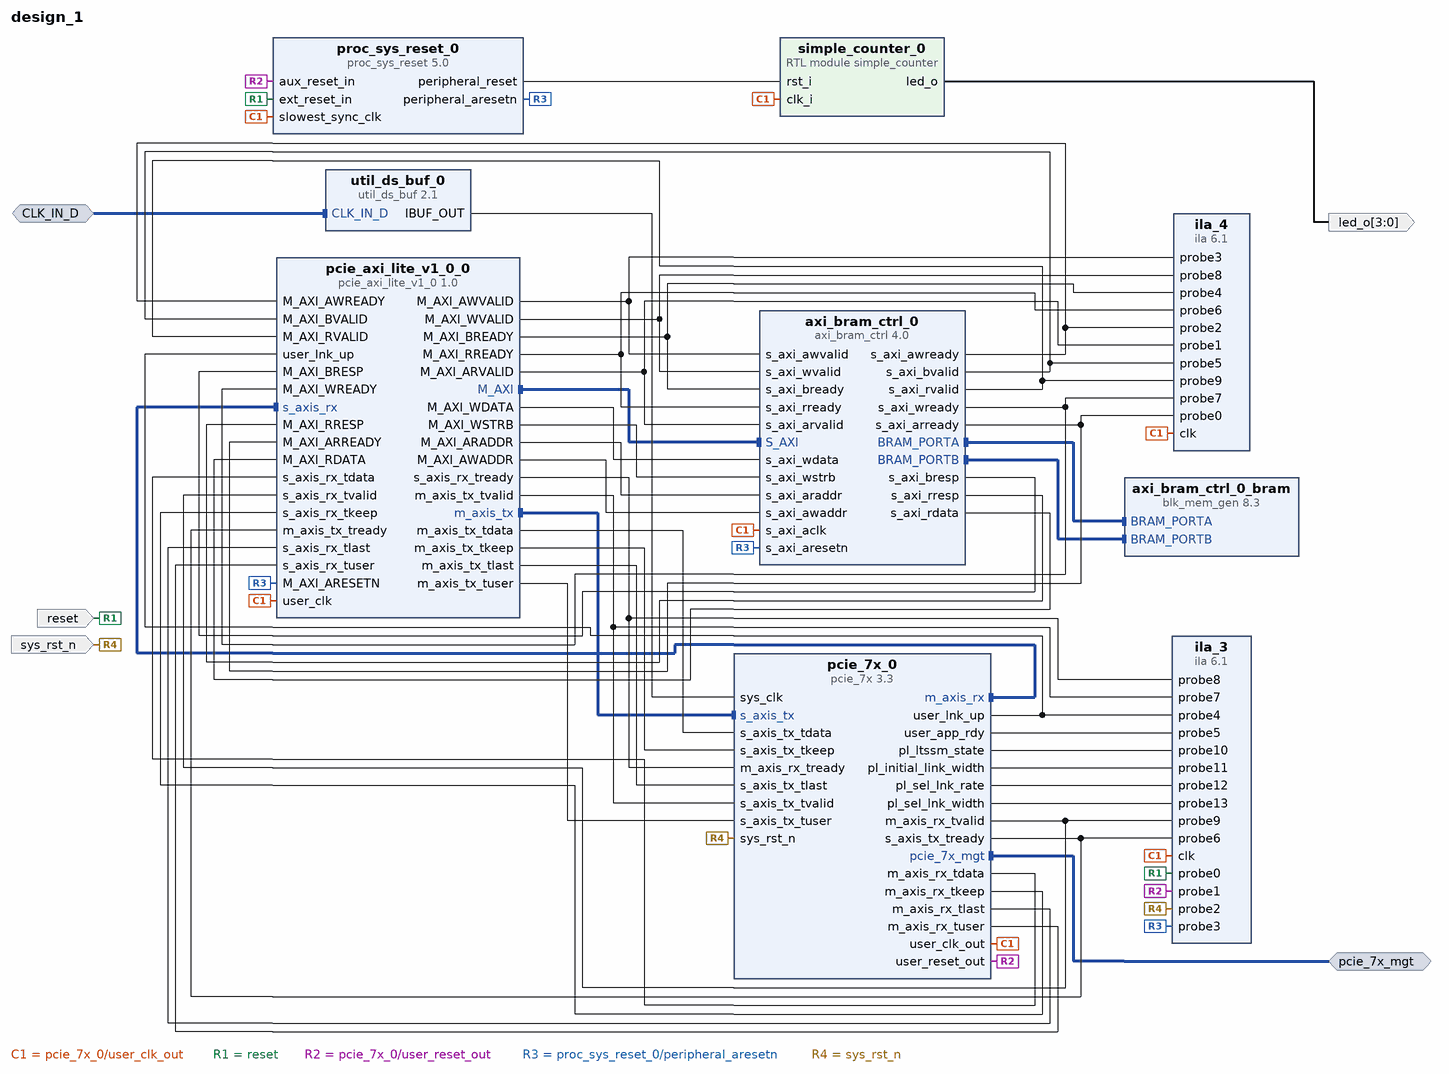
[diagram p0: block diagram of the top level]
# Vivado block design design_1, Vivado 2016.2
create_bd_design design_1

create_bd_intf_port -mode Master -vlnv xilinx.com:interface:pcie_7x_mgt_rtl:1.0 pcie_7x_mgt
create_bd_intf_port -mode Slave -vlnv xilinx.com:interface:diff_clock_rtl:1.0 CLK_IN_D
create_bd_port -dir I -type rst reset
set_property -dict {CONFIG.POLARITY ACTIVE_LOW} [get_bd_ports reset]
create_bd_port -dir O -from 3 -to 0 led_o
create_bd_port -dir I -type rst sys_rst_n

create_bd_cell -type ip -vlnv xilinx.com:ip:axi_bram_ctrl:4.0 axi_bram_ctrl_0
set_property -dict {CONFIG.PROTOCOL AXI4LITE} [get_bd_cells axi_bram_ctrl_0]
create_bd_cell -type ip -vlnv xilinx.com:ip:blk_mem_gen:8.3 axi_bram_ctrl_0_bram
set_property -dict {CONFIG.Memory_Type True_Dual_Port_RAM} [get_bd_cells axi_bram_ctrl_0_bram]
create_bd_cell -type ip -vlnv xilinx.com:user:pcie_axi_lite_v1_0:1.0 pcie_axi_lite_v1_0_0
set_property -dict [list \
  CONFIG.C_DATA_WIDTH 64 \
  CONFIG.BIG_ENDIAN {"1"} \
  CONFIG.AXI_BAR_0_ADDR 0x00000000 \
  CONFIG.AXI_BAR_0_MASK 0xFFFFF000 \
  CONFIG.AXI_BAR_1_MASK 0xFFFFF000 \
] [get_bd_cells pcie_axi_lite_v1_0_0]
create_bd_cell -type ip -vlnv xilinx.com:ip:proc_sys_reset:5.0 proc_sys_reset_0
create_bd_cell -type ip -vlnv xilinx.com:ip:util_ds_buf:2.1 util_ds_buf_0
set_property -dict {CONFIG.C_BUF_TYPE IBUFDSGTE} [get_bd_cells util_ds_buf_0]
create_bd_cell -type ip -vlnv xilinx.com:ip:pcie_7x:3.3 pcie_7x_0
set_property -dict [list \
  CONFIG.mode_selection Advanced \
  CONFIG.Maximum_Link_Width X4 \
  CONFIG.Link_Speed 5.0_GT/s \
  CONFIG.Interface_Width 64_bit \
  CONFIG.User_Clk_Freq 250 \
  CONFIG.Bar0_64bit false \
  CONFIG.Bar0_Scale Kilobytes \
  CONFIG.Bar0_Size 32 \
  CONFIG.Bar1_Enabled true \
  CONFIG.Bar1_Type Memory \
  CONFIG.Bar1_Scale Kilobytes \
  CONFIG.Bar1_Size 4 \
  CONFIG.Bar2_Enabled true \
  CONFIG.Bar2_Type Memory \
  CONFIG.Bar2_64bit false \
  CONFIG.Bar2_Scale Kilobytes \
  CONFIG.Bar2_Size 32 \
  CONFIG.Bar3_Enabled true \
  CONFIG.Bar3_Type Memory \
  CONFIG.Bar3_Scale Kilobytes \
  CONFIG.Bar3_Size 2 \
  CONFIG.Bar4_Enabled true \
  CONFIG.Bar4_Type Memory \
  CONFIG.Bar4_Scale Kilobytes \
  CONFIG.Bar4_Size 2 \
  CONFIG.Bar5_Enabled false \
  CONFIG.Bar5_Type N/A \
  CONFIG.Bar5_Size 2 \
  CONFIG.Device_ID 7024 \
  CONFIG.Max_Payload_Size 512_bytes \
  CONFIG.Trgt_Link_Speed {4'h2} \
  CONFIG.Enable_Slot_Clock_Cfg true \
  CONFIG.MSIx_Table_BIR BAR_0 \
  CONFIG.MSIx_PBA_BIR BAR_0 \
  CONFIG.DSN_Enabled true \
  CONFIG.PCIe_Blk_Locn X0Y0 \
  CONFIG.Trans_Buf_Pipeline None \
  CONFIG.En_route_unlock false \
  CONFIG.PCIe_Debug_Ports false \
  CONFIG.Ref_Clk_Freq 100_MHz \
  CONFIG.RBAR_Num 0 \
  CONFIG.en_ext_clk false \
  CONFIG.pl_interface true \
  CONFIG.cfg_mgmt_if false \
  CONFIG.cfg_ctl_if false \
  CONFIG.cfg_status_if false \
  CONFIG.rcv_msg_if false \
  CONFIG.cfg_fc_if false \
  CONFIG.err_reporting_if false \
  CONFIG.pipe_mode_sim None \
] [get_bd_cells pcie_7x_0]
create_bd_cell -type ip -vlnv xilinx.com:ip:ila:6.1 ila_3
set_property -dict [list \
  CONFIG.C_DATA_DEPTH 131072 \
  CONFIG.C_NUM_OF_PROBES 14 \
  CONFIG.C_INPUT_PIPE_STAGES 6 \
  CONFIG.C_ENABLE_ILA_AXI_MON false \
  CONFIG.C_MONITOR_TYPE Native \
] [get_bd_cells ila_3]
create_bd_cell -type ip -vlnv xilinx.com:ip:ila:6.1 ila_4
set_property -dict [list \
  CONFIG.C_DATA_DEPTH 131072 \
  CONFIG.C_NUM_OF_PROBES 10 \
  CONFIG.C_INPUT_PIPE_STAGES 6 \
  CONFIG.C_ENABLE_ILA_AXI_MON false \
  CONFIG.C_MONITOR_TYPE Native \
] [get_bd_cells ila_4]
create_bd_cell -type module -reference simple_counter simple_counter_0

# ---- connections ----

connect_bd_intf_net [get_bd_intf_pins axi_bram_ctrl_0_bram/BRAM_PORTA] [get_bd_intf_pins axi_bram_ctrl_0/BRAM_PORTA]
connect_bd_intf_net [get_bd_intf_pins axi_bram_ctrl_0_bram/BRAM_PORTB] [get_bd_intf_pins axi_bram_ctrl_0/BRAM_PORTB]
connect_bd_intf_net [get_bd_intf_pins pcie_axi_lite_v1_0_0/M_AXI] [get_bd_intf_pins axi_bram_ctrl_0/S_AXI]
connect_bd_intf_net [get_bd_intf_pins pcie_7x_0/s_axis_tx] [get_bd_intf_pins pcie_axi_lite_v1_0_0/m_axis_tx]
connect_bd_intf_net [get_bd_intf_pins pcie_7x_0/m_axis_rx] [get_bd_intf_pins pcie_axi_lite_v1_0_0/s_axis_rx]
connect_bd_intf_net [get_bd_intf_ports pcie_7x_mgt] [get_bd_intf_pins pcie_7x_0/pcie_7x_mgt]
connect_bd_intf_net [get_bd_intf_ports CLK_IN_D] [get_bd_intf_pins util_ds_buf_0/CLK_IN_D]
connect_bd_net -net clk_wiz_clk_out1 [get_bd_pins pcie_7x_0/user_clk_out] \
  [get_bd_pins axi_bram_ctrl_0/s_axi_aclk] [get_bd_pins pcie_axi_lite_v1_0_0/user_clk] \
  [get_bd_pins proc_sys_reset_0/slowest_sync_clk] [get_bd_pins ila_3/clk] [get_bd_pins ila_4/clk] \
  [get_bd_pins simple_counter_0/clk_i]
connect_bd_net [get_bd_ports reset] [get_bd_pins ila_3/probe0] [get_bd_pins proc_sys_reset_0/ext_reset_in]
connect_bd_net [get_bd_pins util_ds_buf_0/IBUF_OUT] [get_bd_pins pcie_7x_0/sys_clk]
connect_bd_net [get_bd_pins pcie_7x_0/user_lnk_up] [get_bd_pins pcie_axi_lite_v1_0_0/user_lnk_up] [get_bd_pins ila_3/probe4]
connect_bd_net [get_bd_pins pcie_7x_0/user_reset_out] [get_bd_pins proc_sys_reset_0/aux_reset_in] [get_bd_pins ila_3/probe1]
connect_bd_net -net rst_clk_wiz_100M_peripheral_aresetn [get_bd_pins proc_sys_reset_0/peripheral_aresetn] \
  [get_bd_pins axi_bram_ctrl_0/s_axi_aresetn] [get_bd_pins pcie_axi_lite_v1_0_0/M_AXI_ARESETN] [get_bd_pins ila_3/probe3]
connect_bd_net [get_bd_pins simple_counter_0/led_o] [get_bd_ports led_o]
connect_bd_net [get_bd_pins pcie_7x_0/user_app_rdy] [get_bd_pins ila_3/probe5]
connect_bd_net [get_bd_pins pcie_7x_0/m_axis_rx_tdata] [get_bd_pins pcie_axi_lite_v1_0_0/s_axis_rx_tdata]
connect_bd_net [get_bd_pins pcie_7x_0/m_axis_rx_tkeep] [get_bd_pins pcie_axi_lite_v1_0_0/s_axis_rx_tkeep]
connect_bd_net [get_bd_pins pcie_7x_0/m_axis_rx_tlast] [get_bd_pins pcie_axi_lite_v1_0_0/s_axis_rx_tlast]
connect_bd_net [get_bd_pins pcie_7x_0/m_axis_rx_tuser] [get_bd_pins pcie_axi_lite_v1_0_0/s_axis_rx_tuser]
connect_bd_net [get_bd_pins pcie_axi_lite_v1_0_0/s_axis_rx_tready] [get_bd_pins pcie_7x_0/m_axis_rx_tready] [get_bd_pins ila_3/probe8]
connect_bd_net [get_bd_pins pcie_7x_0/m_axis_rx_tvalid] [get_bd_pins pcie_axi_lite_v1_0_0/s_axis_rx_tvalid] [get_bd_pins ila_3/probe9]
connect_bd_net [get_bd_pins pcie_axi_lite_v1_0_0/m_axis_tx_tdata] [get_bd_pins pcie_7x_0/s_axis_tx_tdata]
connect_bd_net [get_bd_pins pcie_axi_lite_v1_0_0/m_axis_tx_tkeep] [get_bd_pins pcie_7x_0/s_axis_tx_tkeep]
connect_bd_net [get_bd_pins pcie_axi_lite_v1_0_0/m_axis_tx_tlast] [get_bd_pins pcie_7x_0/s_axis_tx_tlast]
connect_bd_net [get_bd_pins pcie_7x_0/s_axis_tx_tready] [get_bd_pins pcie_axi_lite_v1_0_0/m_axis_tx_tready] [get_bd_pins ila_3/probe6]
connect_bd_net [get_bd_pins pcie_axi_lite_v1_0_0/m_axis_tx_tuser] [get_bd_pins pcie_7x_0/s_axis_tx_tuser]
connect_bd_net [get_bd_pins pcie_axi_lite_v1_0_0/m_axis_tx_tvalid] [get_bd_pins pcie_7x_0/s_axis_tx_tvalid] [get_bd_pins ila_3/probe7]
connect_bd_net [get_bd_pins pcie_axi_lite_v1_0_0/M_AXI_AWVALID] [get_bd_pins axi_bram_ctrl_0/s_axi_awvalid] [get_bd_pins ila_4/probe3]
connect_bd_net [get_bd_pins axi_bram_ctrl_0/s_axi_awready] [get_bd_pins pcie_axi_lite_v1_0_0/M_AXI_AWREADY] [get_bd_pins ila_4/probe2]
connect_bd_net [get_bd_pins pcie_axi_lite_v1_0_0/M_AXI_WDATA] [get_bd_pins axi_bram_ctrl_0/s_axi_wdata]
connect_bd_net [get_bd_pins axi_bram_ctrl_0/s_axi_bvalid] [get_bd_pins pcie_axi_lite_v1_0_0/M_AXI_BVALID] [get_bd_pins ila_4/probe5]
connect_bd_net [get_bd_pins axi_bram_ctrl_0/s_axi_bresp] [get_bd_pins pcie_axi_lite_v1_0_0/M_AXI_BRESP]
connect_bd_net [get_bd_pins axi_bram_ctrl_0/s_axi_rvalid] [get_bd_pins pcie_axi_lite_v1_0_0/M_AXI_RVALID] [get_bd_pins ila_4/probe9]
connect_bd_net [get_bd_pins axi_bram_ctrl_0/s_axi_rresp] [get_bd_pins pcie_axi_lite_v1_0_0/M_AXI_RRESP]
connect_bd_net [get_bd_pins axi_bram_ctrl_0/s_axi_rdata] [get_bd_pins pcie_axi_lite_v1_0_0/M_AXI_RDATA]
connect_bd_net [get_bd_pins pcie_axi_lite_v1_0_0/M_AXI_WSTRB] [get_bd_pins axi_bram_ctrl_0/s_axi_wstrb]
connect_bd_net [get_bd_pins pcie_axi_lite_v1_0_0/M_AXI_WVALID] [get_bd_pins axi_bram_ctrl_0/s_axi_wvalid] [get_bd_pins ila_4/probe8]
connect_bd_net [get_bd_pins pcie_axi_lite_v1_0_0/M_AXI_BREADY] [get_bd_pins axi_bram_ctrl_0/s_axi_bready] [get_bd_pins ila_4/probe4]
connect_bd_net [get_bd_pins axi_bram_ctrl_0/s_axi_wready] [get_bd_pins pcie_axi_lite_v1_0_0/M_AXI_WREADY] [get_bd_pins ila_4/probe7]
connect_bd_net [get_bd_pins pcie_axi_lite_v1_0_0/M_AXI_RREADY] [get_bd_pins axi_bram_ctrl_0/s_axi_rready] [get_bd_pins ila_4/probe6]
connect_bd_net [get_bd_pins axi_bram_ctrl_0/s_axi_arready] [get_bd_pins pcie_axi_lite_v1_0_0/M_AXI_ARREADY] [get_bd_pins ila_4/probe0]
connect_bd_net [get_bd_pins pcie_axi_lite_v1_0_0/M_AXI_ARVALID] [get_bd_pins axi_bram_ctrl_0/s_axi_arvalid] [get_bd_pins ila_4/probe1]
connect_bd_net [get_bd_pins pcie_axi_lite_v1_0_0/M_AXI_ARADDR] [get_bd_pins axi_bram_ctrl_0/s_axi_araddr]
connect_bd_net [get_bd_pins pcie_axi_lite_v1_0_0/M_AXI_AWADDR] [get_bd_pins axi_bram_ctrl_0/s_axi_awaddr]
connect_bd_net [get_bd_pins pcie_7x_0/pl_ltssm_state] [get_bd_pins ila_3/probe10]
connect_bd_net [get_bd_pins pcie_7x_0/pl_initial_link_width] [get_bd_pins ila_3/probe11]
connect_bd_net [get_bd_pins pcie_7x_0/pl_sel_lnk_rate] [get_bd_pins ila_3/probe12]
connect_bd_net [get_bd_pins pcie_7x_0/pl_sel_lnk_width] [get_bd_pins ila_3/probe13]
connect_bd_net [get_bd_ports sys_rst_n] [get_bd_pins pcie_7x_0/sys_rst_n] [get_bd_pins ila_3/probe2]
connect_bd_net [get_bd_pins proc_sys_reset_0/peripheral_reset] [get_bd_pins simple_counter_0/rst_i]

# ---- address map ----
assign_bd_address -offset 0x00000000 -range 8K -target_address_space [get_bd_addr_spaces pcie_axi_lite_v1_0_0/M_AXI] [get_bd_addr_segs axi_bram_ctrl_0/S_AXI/Mem0]

validate_bd_design
save_bd_design
